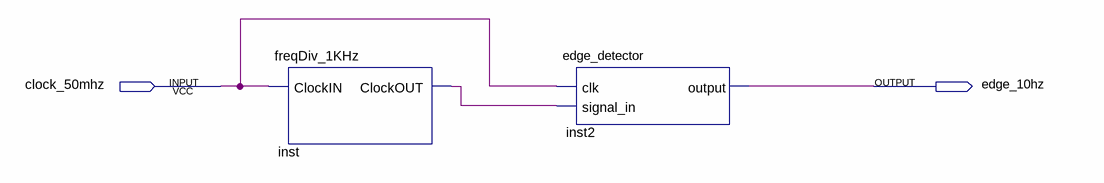
[diagram p0: schematic sheet]
// Quartus schematic teste_edge_detector.bdf as structural Verilog: 2 symbols, 2 pins
module teste_edge_detector (
  input  clock_50mhz,
  output edge_10hz
);

  wire inst_clockout;

  freqDiv_1KHz inst (.ClockIN(clock_50mhz), .ClockOUT(inst_clockout));
  edge_detector inst2 (.clk(clock_50mhz), .signal_in(inst_clockout), .\output (edge_10hz));
endmodule
